# EAGLE design Button (EAGLE 7.3.0)
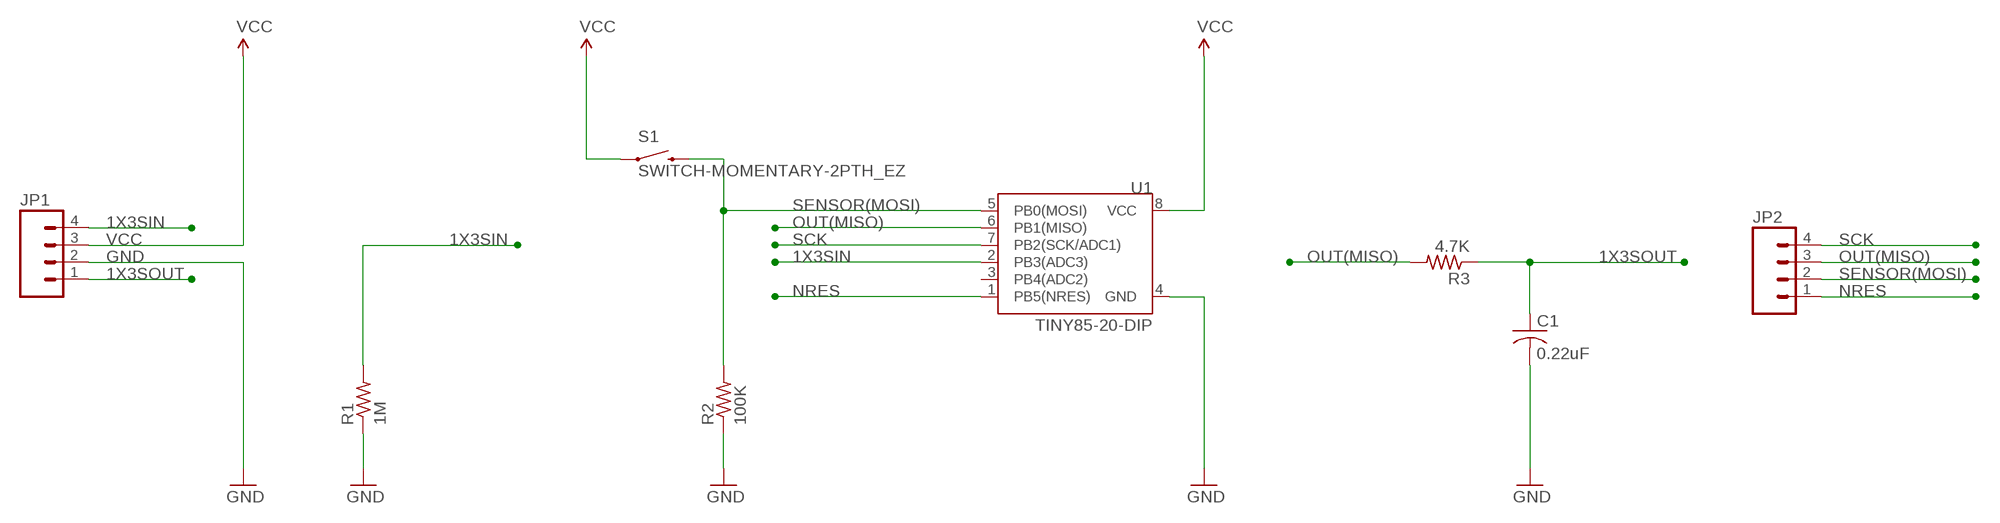
[diagram p0: schematic, sheet 1]

## Parts
C1  0.22uF  C-USC0402  [C0402]
JP1  M04PTH  [1X04]
JP2  M04PTH  [1X04]
R1  1M  R-US_R0603  [R0603]
R2  100K  R-US_R0603  [R0603]
R3  4.7K  R-US_R0603  [R0603]
S1  SWITCH-MOMENTARY-2PTH_EZ  [TACTILE-PTH-EZ]
U1  TINY85-20-DIP  ATTINY45TINY85-20-DIP  [DIP08]

## Nets
1X3SIN: JP1.4 R1.2 U1.2(PB3(ADC3))
1X3SOUT: C1.1 JP1.1 R3.1
GND: C1.2 JP1.2 R1.1 R2.1 U1.4(GND)
NRES: JP2.1 U1.1(PB5(NRES))
OUT(MISO): JP2.3 R3.2 U1.6(PB1(MISO))
SCK: JP2.4 U1.7(PB2(SCK/ADC1))
SENSOR(MOSI): JP2.2 R2.2 S1.3 U1.5(PB0(MOSI))
VCC: JP1.3 S1.1 U1.8(VCC)
Unconnected: U1.3(PB4(ADC2))

## Library data of the parts
C1 = adafruit:C-US: CAPACITOR, American symbol
JP1 JP2 = SparkFun-Connectors:M04: Header 4 Standard 4-pin 0.1" header. Use with straight break away headers (SKU : PRT-00116), right angle break away headers (PRT-00553), swiss pins (PRT-00743), machine pins (PRT-00117), and female headers (PRT-00115). Molex polarized connector foot print use with SKU : PRT-08231 with associated crimp pins and housings. 1MM SMD Version SKU: PRT-10208
R1-R3 = adafruit:R-US_: RESISTOR, American symbol
S1 = SparkFun-Electromechanical:SWITCH-MOMENTARY-2: Various NO switches- pushbuttons, reed, etc
U1 = SparkFun-DigitalIC:ATTINY45: Atmel 8-pin 2/4/8kB flash uC; PROD_ID: IC-09445

## Board
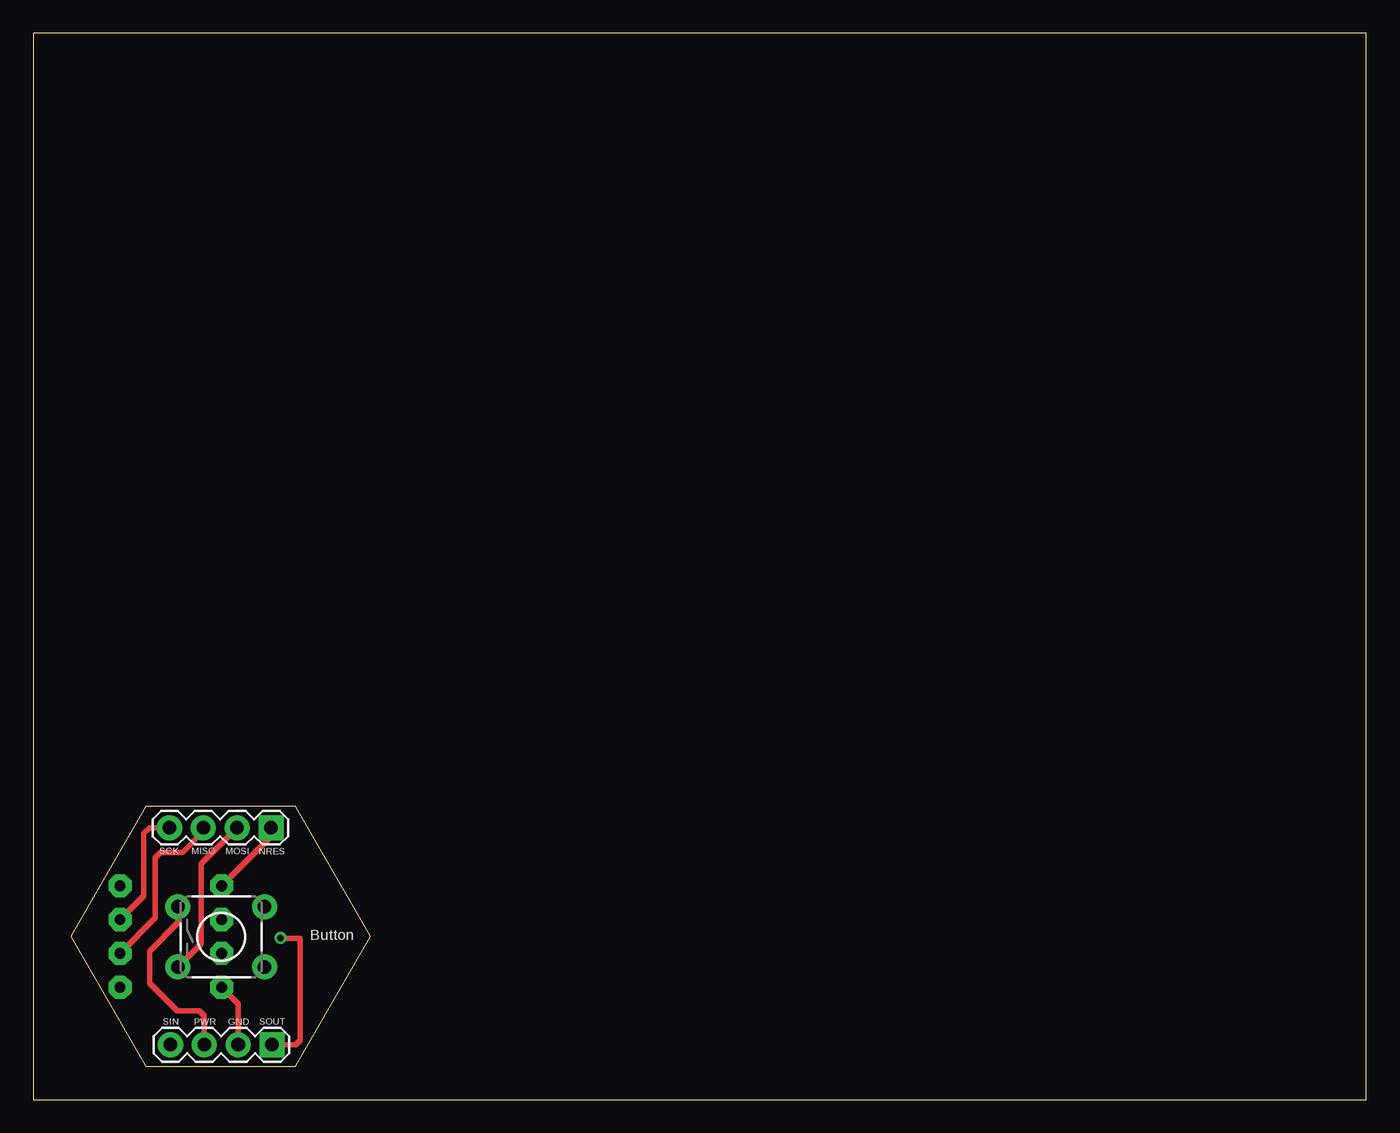
[diagram p1: board, top side]
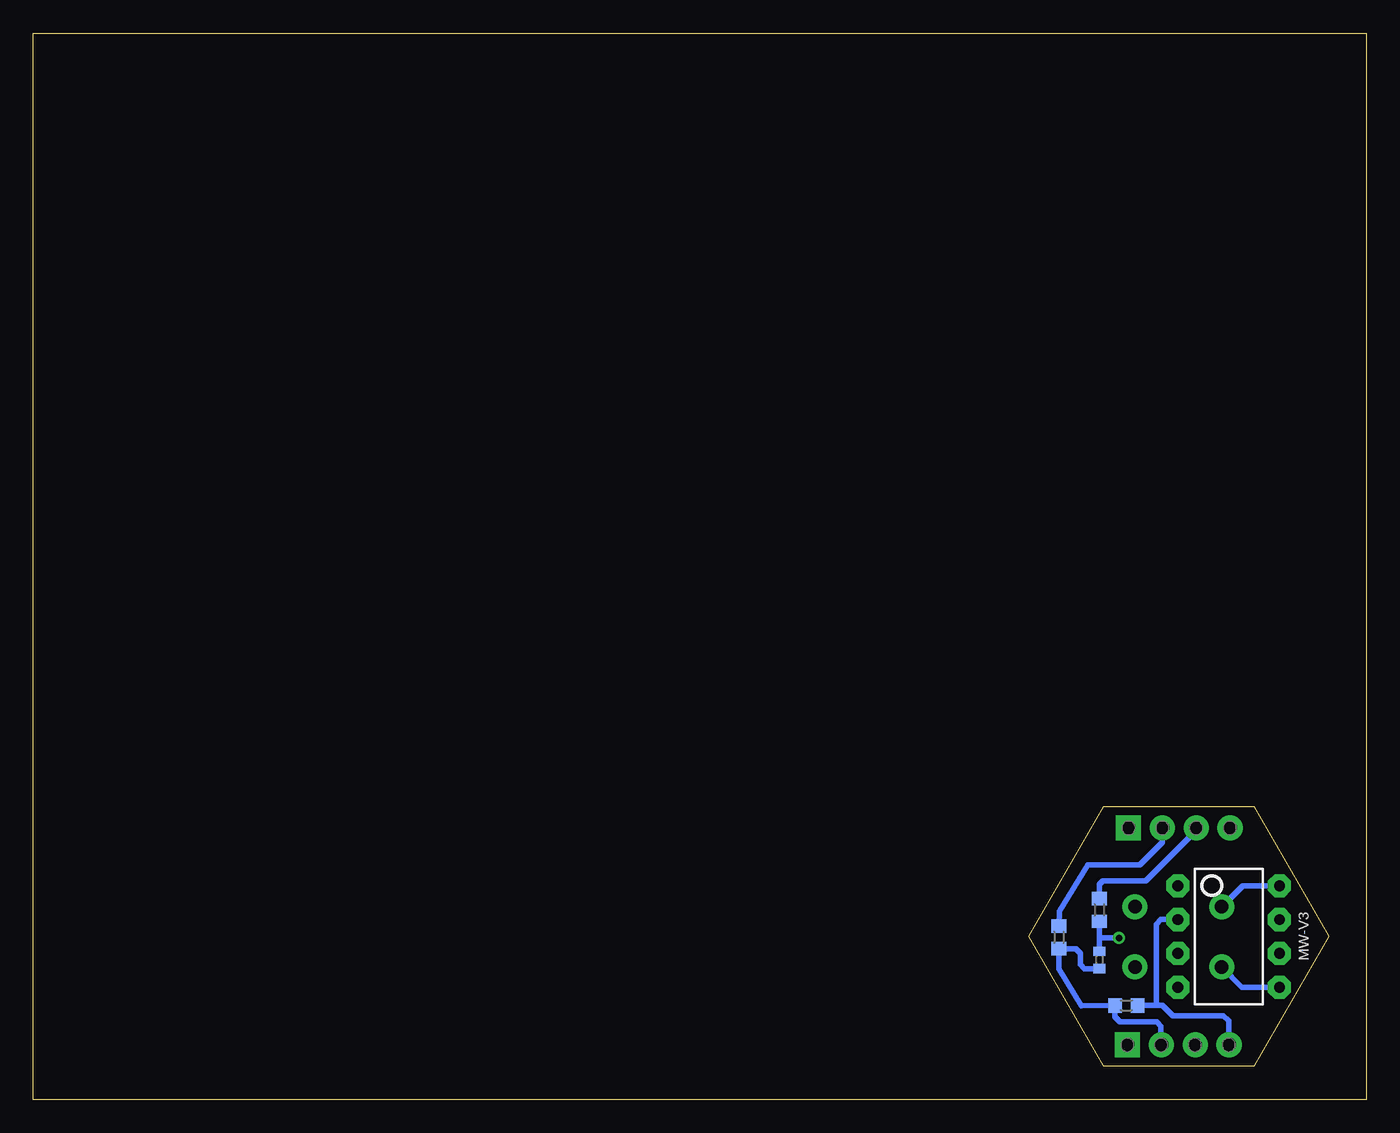
[diagram p2: board, bottom side, seen from below]

Size 100 x 80 mm. Coordinates in mm from the lower left corner, seen from the top.
Outline: 0,0 100,0 100,80 0,80 0,0
Outline: 8.45,2.5 19.7,2.5 25.32,12.24 19.7,21.98 8.45,21.98 2.82,12.24 8.45,2.5
Copper layers (1*16): Top 0.035mm / dielectric 1.5mm / Bottom 0.035mm
Design rules "default": minimum track width 10mil, minimum drill 24mil, track to track 8mil, track to pad 8mil, pad to pad 8mil, via to via 8mil, smd to smd 8mil, copper to edge 40mil, drill to drill 8mil, minimum pad ring 10mil, minimum via ring 8mil, stop-mask expansion 4mil, vias tented up to drill 0mil, thermal gap 10mil

### Footprints (pad centres in the part's own frame; a part is rotated, then mirrored left to right if it is on the bottom)
C0402 = smd 0.7 x 0.9: 1 -0.65,0; 2 0.65,0
1X04 = drill 1.016 pad 1.88 square: 1 0,0 | drill 1.016 pad 1.88: 2 2.54,0; 3 5.08,0; 4 7.62,0
R0603 = smd 1 x 1.1: 1 -0.85,0; 2 0.85,0
TACTILE-PTH-EZ = drill 1.016 pad 1.88: 1 -3.251,2.261; 2 3.251,2.261; 3 -3.251,-2.261; 4 3.251,-2.261
DIP08 = drill 0.813 pad 1.727 octagon: 1 -3.81,-3.81; 2 -1.27,-3.81; 3 1.27,-3.81; 4 3.81,-3.81; 5 3.81,3.81; 6 1.27,3.81; 7 -1.27,3.81; 8 -3.81,3.81

### Placement (x,y rotation side)
C1  20.02,10.46 270 bottom
JP1  17.91,4.11 180 top
JP2  17.83,20.4 180 top
R1  18,7.06 0 bottom
R2  23.05,12.17 90 bottom
R3  20.02,14.22 90 bottom
S1  14.1,12.2 0 top
U1  10.31,12.23 270 bottom

### Tracks (layer width: path | path; a pad name or v marks a point on that pad's centre or on a via)
1X3SIN
  Bottom 0.4: R1.2 15.71,7.06 | 15.71,7.06 15.28,7.06 14.52,6.3 10.71,6.3 10.31,5.91 10.31,4.14 JP1.4 | U1.2 15.39,13.5 15.75,13.14 15.75,7.1 15.71,7.06
1X3SOUT  (via drill 0.5)
  Top 0.4: JP1.1 19.68,4.12 20.03,4.46 20.03,12.08 20.02,12.09 18.57,12.09 v18.54,12.12
  Bottom 0.4: C1.1 20.02,12.04 | 20.02,12.04 R3.1 | v18.54,12.12 19.94,12.12 20.02,12.04
GND
  Top 0.4: JP1.2 15.37,7.18 U1.4
  Bottom 0.4: JP1.2 15.4,4.15 15.4,5.51 15.72,5.83 18.48,5.83 18.85,6.2 R1.1 21.39,7.05 23.05,9.8 R2.1 23.04,11.3 21.78,11.3 21.45,10.97 21.45,10.13 21.13,9.81 C1.2
NRES
  Top 0.4: JP2.1 17.83,19.75 U1.1
OUT(MISO)
  Top 0.4: JP2.3 12.75,20.1 11.19,18.54 9.55,18.54 9.16,18.15 9.16,13.61 U1.6
  Bottom 0.4: R3.2 20.02,16.15 19.76,16.41 16.52,16.41 13.11,19.82 13.11,20.04 JP2.3
SCK
  Top 0.4: JP2.4 8.72,20.4 8.29,19.96 8.29,15.29 U1.7
SENSOR(MOSI)
  Top 0.4: S1.3 12.59,11.67 12.59,17.69 JP2.2
  Bottom 0.4: JP2.2 15.29,19.3 16.98,17.61 20.87,17.61 23.01,14.12 R2.2 | U1.5 9.32,8.42 S1.3
VCC
  Top 0.4: S1.1 10.85,13.25 8.72,11.12 8.72,8.71 10.79,6.64 12.43,6.64 12.8,6.27 12.8,4.14 JP1.3
  Bottom 0.4: U1.8 9.27,16.04 S1.1

### Text on the board
tPlace: SCK | MISO | MOSI | NRES | Button | SIN | PWR | GND | SOUT
bPlace: MW-V3